# EAGLE schematic Arduino-Teensy-v5_PLUS_ESP-12E_4LAYER (EAGLE 8.6.0)
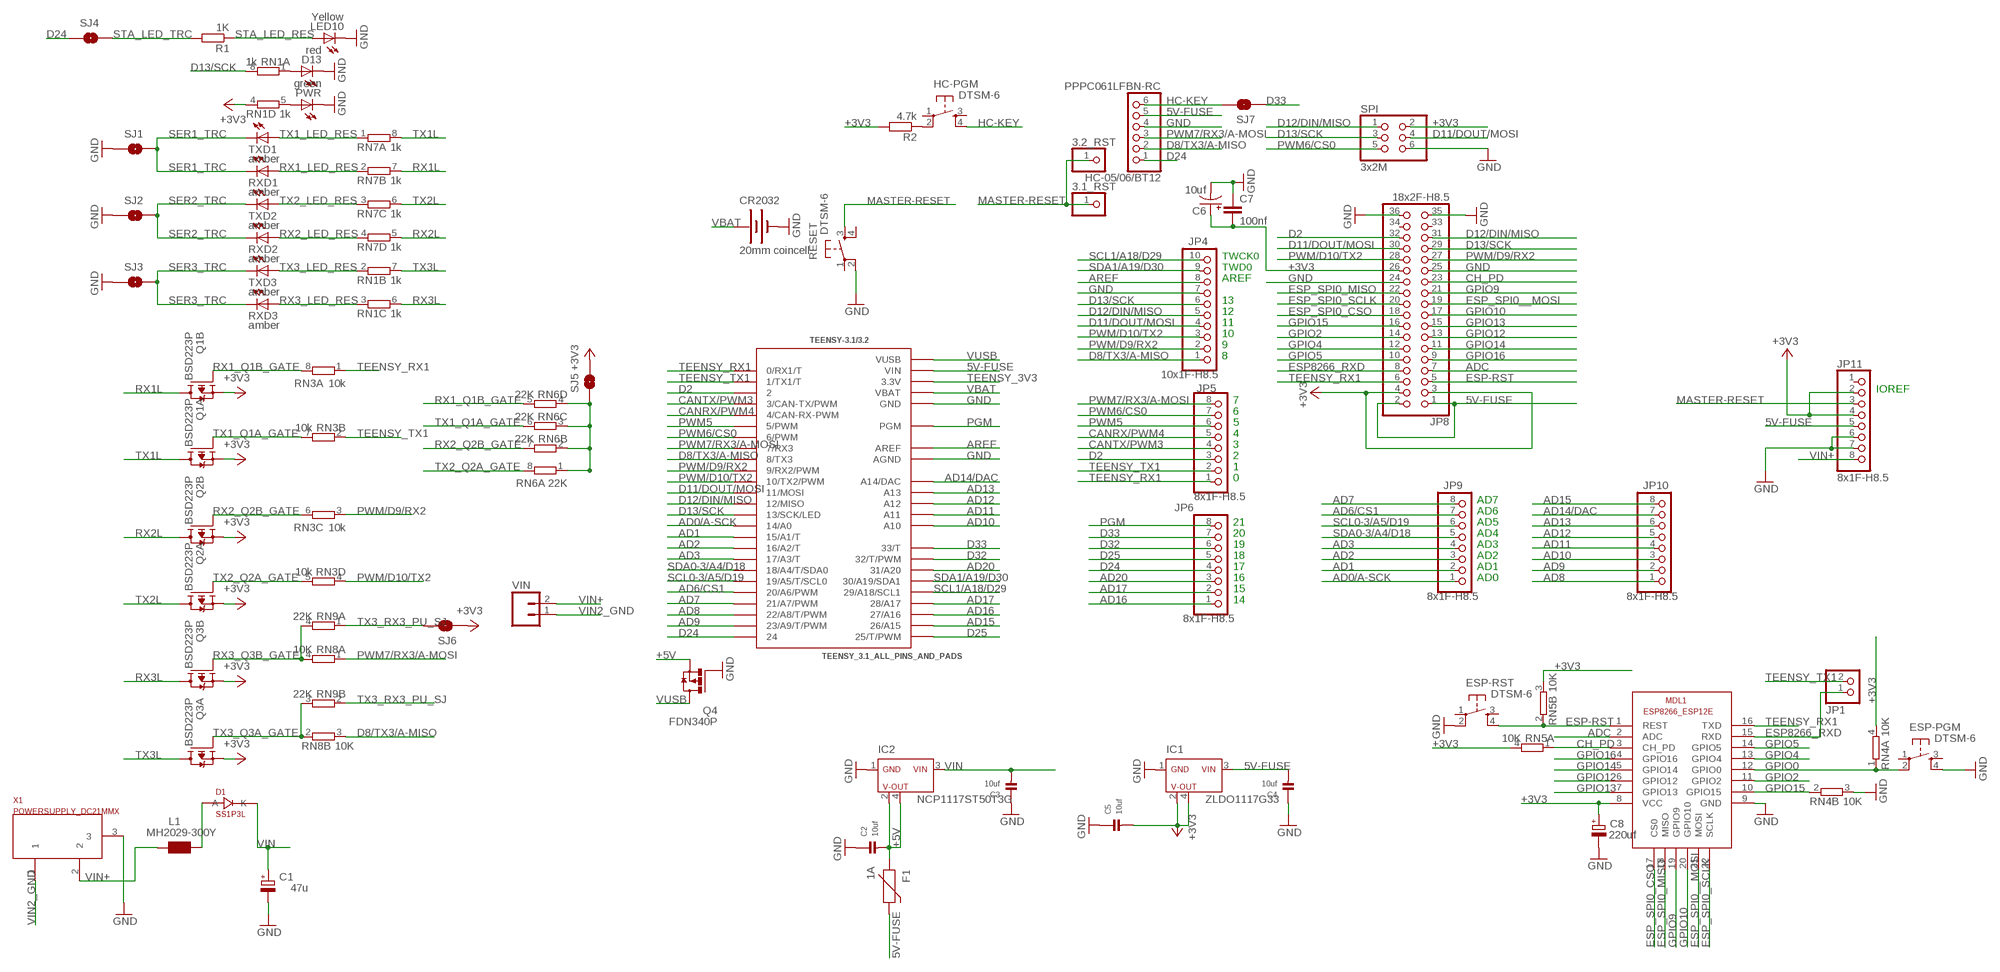
[diagram p0: schematic, sheet 1]

## Parts
3.1_RST  PINHD-1X1CB  [1X01-CLEANBIG]
3.2_RST  PINHD-1X1CB  [1X01-CLEANBIG]
C1  47u  CPOL-EUD  [PANASONIC_D]
C2  10uf  CAP_CERAMIC0805  [0805]
C3  10uf  CAP_CERAMIC0805  [0805]
C4  10uf  CAP_CERAMIC0805  [0805]
C5  10uf  CAP_CERAMIC0805  [0805]
C6  10uf  CPOL-USA/3216-18R  [A/3216-18R]
C7  100nf  C-EUC0603  [C0603-ROUND]
C8  220uf  CPOL-EUSMCB  [SMC_B]
CR2032  20mm coincell  BATTERY20MM_4LEGS  [BATTCON_20MM_4LEGS]
D1  SS1P3L  [DO220AAL]
D13  red  LEDCHIPLED_0805  [CHIPLED_0805]
ESP-PGM  DTSM-6  [DTSM-6]
ESP-RST  DTSM-6  [DTSM-6]
F1  1A  PTCSMD  [PTC-1206]
HC-05/06/BT12  PPPC061LFBN-RC  PINHD-1X6  [1X06]
HC-PGM  DTSM-6  [DTSM-6]
IC1  ZLDO1117G33  [SOT223]
IC2  NCP1117ST50T3G  [SOT223]
JP1  PINHD-1X2  [1X02]
JP4  10x1F-H8.5  PINHD-1X10  [1X10]
JP5  8x1F-H8.5  PINHD-1X8  [1X08]
JP6  8x1F-H8.5  PINHD-1X8  [1X08]
JP8  18x2F-H8.5  PINHD-2X18  [2X18]
JP9  8x1F-H8.5  PINHD-1X8  [1X08]
JP10  8x1F-H8.5  PINHD-1X8  [1X08]
JP11  8x1F-H8.5  PINHD-1X8  [1X08]
L1  MH2029-300Y  WE-CBF_0805  [0805]
LED10  Yellow  LEDCHIPLED_0805  [CHIPLED_0805]
MDL1  ESP8266-12E)  ESP8266-12EESP8266-ESP12E  [ESP8266-ESP12E]
PWR  green  LEDCHIPLED_0805  [CHIPLED_0805]
Q1  BSD223P  [SOT363_INFINEON]
Q2  BSD223P  [SOT363_INFINEON]
Q3  BSD223P  [SOT363_INFINEON]
Q4  FDN340P  FDN360P  [SUPER-SOT3]
R1  1K  R-EU_R0603  [R0603]
R2  4.7k  R-EU_R0603  [R0603]
RESET  DTSM-6  [DTSM-6]
RN1  1k  4R-NCAT16  [CAT16]
RN3  10k  4R-NCAT16  [CAT16]
RN4  10K  2R-NEXB34V  [EXB34V]
RN5  10K  2R-NEXB34V  [EXB34V]
RN6  22K  4R-NCAT16  [CAT16]
RN7  1k  4R-NCAT16  [CAT16]
RN8  10K  2R-NEXB34V  [EXB34V]
RN9  22K  2R-NEXB34V  [EXB34V]
RXD1  amber  LEDCHIPLED_0805  [CHIPLED_0805]
RXD2  amber  LEDCHIPLED_0805  [CHIPLED_0805]
RXD3  amber  LEDCHIPLED_0805  [CHIPLED_0805]
SJ1  SOLDERJUMPERTRACE  [SJ_2S-TRACE]
SJ2  SOLDERJUMPERTRACE  [SJ_2S-TRACE]
SJ3  SOLDERJUMPERTRACE  [SJ_2S-TRACE]
SJ4  SOLDERJUMPERTRACE  [SJ_2S-TRACE]
SJ5  SOLDERJUMPERTRACE  [SJ_2S-TRACE]
SJ6  SOLDERJUMPERTRACE  [SJ_2S-TRACE]
SJ7  SOLDERJUMPERTRACE  [SJ_2S-TRACE]
SPI  3x2M  PINHD-2X3  [2X03]
TEENSY-3.1/3.2  TEENSY_3.1_ALL_PINS_AND_PADS  [TEENSY3_ALL_PINS_&_PADS]
TXD1  amber  LEDCHIPLED_0805  [CHIPLED_0805]
TXD2  amber  LEDCHIPLED_0805  [CHIPLED_0805]
TXD3  amber  LEDCHIPLED_0805  [CHIPLED_0805]
VIN  M02LOCK_LONGPADS  [1X02_LOCK_LONGPADS]
X1  POWERSUPPLY_DC21MMX  [POWERSUPPLY_DC-21MM]

## Nets
5V-FUSE [POWER]: C4.2 F1.2 HC-05/06/BT12.5 IC1.3(VIN) JP8.1 JP8.2 JP11.5 TEENSY-3.1/3.2.VIN
+3V3 [POWER]: C5.2 C6.+ C7.2 C8.+ IC1.2(VOUT) IC1.4(VOUT) JP8.3 JP8.4 JP8.26 JP11.2 JP11.4 MDL1.8(VCC) Q1.1(A:S) Q1.4(B:S) Q2.1(A:S) Q2.4(B:S) Q3.1(A:S) Q3.4(B:S) R2.2 RN1.4 RN4.4 RN5.3 RN5.4 SJ5.2 SJ6.1 SPI.2
+5V [POWER]: C2.2 F1.1 IC2.2(VOUT) IC2.4(VOUT) Q4.2(S)
AD0/A-SCK: JP9.1 TEENSY-3.1/3.2.14/A0
AD1: JP9.2 TEENSY-3.1/3.2.15/A1(15/A1/T)
AD2: JP9.3 TEENSY-3.1/3.2.16/A2(16/A2/T)
AD3: JP9.4 TEENSY-3.1/3.2.17/A3(17/A3/T)
AD6/CS1: JP9.7 TEENSY-3.1/3.2.20/A6(20/A6/PWM)
AD7: JP9.8 TEENSY-3.1/3.2.21/A7(21/A7/PWM)
AD8: JP10.1 TEENSY-3.1/3.2.22/A8(22/A8/T/PWM)
AD9: JP10.2 TEENSY-3.1/3.2.23/A9(23/A9/T/PWM)
AD10: JP10.3 TEENSY-3.1/3.2.A10
AD11: JP10.4 TEENSY-3.1/3.2.A11
AD12: JP10.5 TEENSY-3.1/3.2.A12
AD13: JP10.6 TEENSY-3.1/3.2.A13
AD14/DAC: JP10.7 TEENSY-3.1/3.2.RESET/DAC(A14/DAC)
AD15: JP10.8 TEENSY-3.1/3.2.26(26/A15)
AD16: JP6.1 TEENSY-3.1/3.2.27(27/A16)
AD17: JP6.2 TEENSY-3.1/3.2.28(28/A17)
AD20: JP6.3 TEENSY-3.1/3.2.31(31/A20)
ADC: JP8.7 MDL1.2(ADC)
AREF: JP4.8 TEENSY-3.1/3.2.AREF
CANRX/PWM4: JP5.5 TEENSY-3.1/3.2.4(4/CAN-RX-PWM)
CANTX/PWM3: JP5.4 TEENSY-3.1/3.2.3(3/CAN-TX/PWM)
CH_PD: JP8.23 MDL1.3(CH_PD) RN5.1
D2: JP5.3 JP8.32 TEENSY-3.1/3.2.2
D8/TX3/A-MISO: HC-05/06/BT12.2 JP4.1 RN8.3 TEENSY-3.1/3.2.8(8/TX3)
D11/DOUT/MOSI: JP4.4 JP8.30 SPI.4 TEENSY-3.1/3.2.11(11/MOSI)
D12/DIN/MISO: JP4.5 JP8.31 SPI.1 TEENSY-3.1/3.2.12(12/MISO)
D13/SCK: JP4.6 JP8.29 RN1.8 SPI.3 TEENSY-3.1/3.2.13(13/SCK/LED)
D24: HC-05/06/BT12.1 JP6.4 SJ4.1 TEENSY-3.1/3.2.24
D25: JP6.5 TEENSY-3.1/3.2.25(25/T/PWM)
D32: JP6.6 TEENSY-3.1/3.2.32(32/T/PWM)
D33: JP6.7 SJ7.2 TEENSY-3.1/3.2.33(33/T)
ESP8266_RXD: JP1.1 JP8.8 MDL1.15(RXD)
ESP-RST: ESP-RST.4 JP8.5 MDL1.1(REST) RN5.2
ESP_SPI0__MOSI: JP8.19 MDL1.21(MOSI)
ESP_SPI0_CSO: JP8.18 MDL1.17(CS0)
ESP_SPI0_MISO: JP8.22 MDL1.18(MISO)
ESP_SPI0_SCLK: JP8.20 MDL1.22(SCLK)
GND: C1.- C2.1 C3.1 C4.1 C5.1 C6.- C7.1 C8.- CR2032.NEGATIVE(-) D13.C ESP-PGM.4 ESP-RST.2 HC-05/06/BT12.4 IC1.1(GND) IC2.1(GND) JP4.7 JP8.24 JP8.25 JP8.35 JP8.36 JP11.6 JP11.7 LED10.C MDL1.9(GND) PWR.C Q4.1(G) RESET.2 RN4.3 SJ1.1 SJ2.1 SJ3.1 SPI.6 TEENSY-3.1/3.2.AGND TEENSY-3.1/3.2.GND TEENSY-3.1/3.2.GND1(GND) TEENSY-3.1/3.2.GND2(GND) X1.3
GPIO0: ESP-PGM.2 MDL1.12(GPIO0) RN4.1
GPIO2: JP8.14 MDL1.11(GPIO2)
GPIO4: JP8.12 MDL1.13(GPIO4)
GPIO5: JP8.10 MDL1.14(GPIO5)
GPIO9: JP8.21 MDL1.19(GPIO9)
GPIO10: JP8.17 MDL1.20(GPIO10)
GPIO12: JP8.13 MDL1.6(GPIO12)
GPIO13: JP8.15 MDL1.7(GPIO13)
GPIO14: JP8.11 MDL1.5(GPIO14)
GPIO15: JP8.16 MDL1.10(GPIO15) RN4.2
GPIO16: JP8.9 MDL1.4(GPIO16)
HC-KEY: HC-05/06/BT12.6 HC-PGM.4 SJ7.1
MASTER-RESET: 3.1_RST.1 3.2_RST.1 JP11.3 RESET.3
N$2: PWR.A RN1.5
N$3: D13.A RN1.1
N$4: HC-PGM.2 R2.1
PGM: JP6.8 TEENSY-3.1/3.2.PGM
PWM5: JP5.6 TEENSY-3.1/3.2.5(5/PWM)
PWM6/CS0: JP5.7 SPI.5 TEENSY-3.1/3.2.6(6/PWM)
PWM7/RX3/A-MOSI: HC-05/06/BT12.3 JP5.8 RN8.1 TEENSY-3.1/3.2.7(7/RX3)
PWM/D9/RX2: JP4.2 JP8.27 RN3.3 TEENSY-3.1/3.2.9(9/RX2/PWM)
PWM/D10/TX2: JP4.3 JP8.28 RN3.4 TEENSY-3.1/3.2.10(10/TX2/PWM)
RX1_LED_RES: RN7.2 RXD1.A
RX1_Q1B_GATE: Q1.5(B:G) RN3.8 RN6.5
RX1_TX1_RX2_TX2_PU_SJ: RN6.1 RN6.2 RN6.3 RN6.4 SJ5.1
RX1L: Q1.3(B:D) RN7.7
RX2_LED_RES: RN7.4 RXD2.A
RX2_Q2B_GATE: Q2.5(B:G) RN3.6 RN6.7
RX2L: Q2.3(B:D) RN7.5
RX3_LED_RES: RN1.3 RXD3.A
RX3_Q3B_GATE: Q3.5(B:G) RN8.4 RN9.4
RX3L: Q3.3(B:D) RN1.6
SCL0-3/A5/D19: JP9.6 TEENSY-3.1/3.2.19/A5(19/A5/T/SCL0)
SCL1/A18/D29: JP4.10 TEENSY-3.1/3.2.29(29/A18/SCL1)
SDA0-3/A4/D18: JP9.5 TEENSY-3.1/3.2.18/A4(18/A4/T/SDA0)
SDA1/A19/D30: JP4.9 TEENSY-3.1/3.2.30(30/A19/SDA1)
SER1_TRC: RXD1.C SJ1.2 TXD1.C
SER2_TRC: RXD2.C SJ2.2 TXD2.C
SER3_TRC: RXD3.C SJ3.2 TXD3.C
STA_LED_RES: LED10.A R1.1
STA_LED_TRC: R1.2 SJ4.2
TEENSY_3V3 [POWER]: TEENSY-3.1/3.2.3.3V TEENSY-3.1/3.2.3.3V1(3.3V) TEENSY-3.1/3.2.3.3V2(3.3V)
TEENSY_RX1: JP5.1 JP8.6 MDL1.16(TXD) RN3.1 TEENSY-3.1/3.2.0(0/RX1/T)
TEENSY_TX1: JP1.2 JP5.2 RN3.2 TEENSY-3.1/3.2.1(1/TX1/T)
TX1_LED_RES: RN7.1 TXD1.A
TX1_Q1A_GATE: Q1.2(A:G) RN3.7 RN6.6
TX1L: Q1.6(A:D) RN7.8
TX2_LED_RES: RN7.3 TXD2.A
TX2_Q2A_GATE: Q2.2(A:G) RN3.5 RN6.8
TX2L: Q2.6(A:D) RN7.6
TX3_LED_RES: RN1.2 TXD3.A
TX3_Q3A_GATE: Q3.2(A:G) RN8.2 RN9.3
TX3_RX3_PU_SJ: RN9.1 RN9.2 SJ6.2
TX3L: Q3.6(A:D) RN1.7
VBAT: CR2032.POSITIVE@1(+) CR2032.POSITIVE@2(+) CR2032.POSITIVE@3(+) CR2032.POSITIVE@4(+) TEENSY-3.1/3.2.VBAT
VIN [POWER]: C1.+ C3.2 D1.P$1(K) IC2.3(VIN)
VIN2_GND: VIN.1 X1.1
VIN+ [POWER]: JP11.8 L1.2 VIN.2 X1.2
VIN_FER_DIO [POWER]: D1.P$2(A) L1.1
VUSB [POWER]: Q4.3(D) TEENSY-3.1/3.2.VUSB
Unconnected: ESP-PGM.1 ESP-PGM.3 ESP-RST.1 ESP-RST.3 HC-PGM.1 HC-PGM.3 JP8.33 JP8.34 JP11.1 RESET.1 RESET.4

## Notes on the sheet
- TWCK0
- TWD0
- AREF
- 13
- 12
- 11
- 10
- 9
- 8
- IOREF
- 7
- 6
- 5
- 4
- 3
- 2
- 1
- 0
- AD7
- AD6
- 21 | AD5
- 20 | AD4
- 19 | AD3
- 18 | AD2
- 17 | AD1
- 16 | AD0
- 15
- 14

## Library data of the parts
3.1_RST 3.2_RST = adafruit:PINHD-1X1: Pin header 1x1 for 0.1" spacing With round pins
C1 C8 = rcl:CPOL-EU: POLARIZED CAPACITOR, European symbol
C2-C5 = Adafruit_LSM303DLHC:CAP_CERAMIC: Ceramic Capacitors 0402 - 0402 Surface Mount Capacitors 16pF 50V 5% [Digikey: 445-4899-2-ND] 18pF 50V 5% [Digikey: 490-1281-2-ND] 22pF 50V 5% [Digikey: 490-1283-2-ND] 68pF 50V 5% [Digikey: 490-1289-2-ND] 0.1uF 10V 10% [Digikey: 490-1318-2-ND] 1.0uF 6.3V 10% [Digikey: 490-1320-2-ND] 0603 - 0603 Surface Mount Capacitors 16 pF 50V 5% [Digikey: 445-5051-2-ND] 22 pF 50V [Digikey: PCC220ACVTR-ND] 33 pF 50V 5% [Digikey: 490-1415-1-ND] 56pF 50V 5% [Digikey: 490-1421-1-ND] 220pF 50V 5% [Digikey: 445-1285-1-ND] 680 pF 50V 2200 pF 50V 5% C0G [Digikey: 445-1297-1-ND] 5600 pF 100V 5% X7R [Digikey: 478-3711-1-ND] 0.1 µF 25V 10% [Digikey: PCC2277TR-ND] 0.22 µF 16V 10% X7R [Digikey: 445-1318-1-ND] 1.0 µF 25V 10% [Digikey: 445-5146-2-ND] 0603 - RF Specific 3pF 250V +/-0.1pF RF [Digikey: 712-1347-1-ND] 18 pF 250V 5% [Digikey: 478-3505-1-ND or 712-1322-1-ND] 56 pF 250V 5% C0G RF [Digikey: 490-4867-1-ND] 68 pF 250V RF [Digikey: 490-4868-1-ND] 0805 - 0805 Surface Mount Capacitors 220 pF 250V 2% RF Ceramic Capacitor [Digikey: 712-1398-1-ND] 1000 pF 50V 2% NP0 Ceramic Capacitor [Digikey: 478-3760-1-ND] 0.1 µF 25V 10% Ceramic Capacitor [Digikey: PCC1828TR-ND] 1.0 µF 16V 10% Ceramic Capacitor[Digikey: 490-1691-2-ND] 10.0 µF 10V 10% Ceramic Capacitor[Digikey: 709-1228-1-ND] 10.0 uF 16V 10% Ceramic Capacitor [Digikey: 478-5165-2-ND] 47 uF 6.3V 20% Ceramic Capacitor [Digikey: 587-1779-1-ND or 399-5506-1-ND] 1206 - 1206 Surface Mount Capacitors 47uF 10V 20% Ceramic Capacitor [Digikey: 490-5528-1-ND or 399-5508-1-ND or 445-6010-1-ND] 100uF 6.3V -20%, +80% Y5V Ceramic Capacitor (Digikey: 490-4512-1-ND, Mouser: 81-GRM31CF50J107ZE1L)
C6 = adafruit:CPOL-US: POLARIZED CAPACITOR, American symbol
C7 = SmartPrj:C-EU: CAPACITOR, European symbol
CR2032 = SparkFun-Electromechanical:BATTERY: Battery Holders Various common sizes : AA, AAA, 18650 (PRT-12895), 20mm coin cell and 12mm coin cell. 20MM_4LEGS, BATT-10373; PROD_ID: BATT-10373
D1 = SmartPrj:SS1P3L
D13 LED10 PWR RXD1-RXD3 TXD1-TXD3 = adafruit:LED: LED OSRAM: - CHIPLED LG R971, LG N971, LY N971, LG Q971, LY Q971, LO R971, LY R971 LH N974, LH R974 LS Q976, LO Q976, LY Q976 LO Q996 - Hyper CHIPLED LW Q18S LB Q993, LB Q99A, LB R99A - SideLED LS A670, LO A670, LY A670, LG A670, LP A670 LB A673, LV A673, LT A673, LW A673 LH A674 LY A675 LS A676, LA A676, LO A676, LY A676, LW A676 LS A679, LY A679, LG A679 - Hyper Micro SIDELED® LS Y876, LA Y876, LO Y876, LY Y876 LT Y87S - SmartLED LW L88C, LW L88S LB L89C, LB L89S, LG L890 LS L89K, LO L89K, LY L89K LS L896, LA L896, LO L896, LY L896 - TOPLED LS T670, LO T670, LY T670, LG T670, LP T670 LSG T670, LSP T670, LSY T670, LOP T670, LYG T670 LG T671, LOG T671, LSG T671 LB T673, LV T673, LT T673, LW T673 LH T674 LS T676, LA T676, LO T676, LY T676, LB T676, LH T676, LSB T676, LW T676 LB T67C, LV T67C, LT T67C, LS T67K, LO T67K, LY T67K, LW E67C LS E67B, LA E67B, LO E67B, LY E67B, LB E67C, LV E67C, LT E67C LW T67C LS T679, LY T679, LG T679 LS T770, LO T770, LY T770, LG T770, LP T770 LB T773, LV T773, LT T773, LW T773 LH T774 LS E675, LA E675, LY E675, LS T675 LS T776, LA T776, LO T776, LY T776, LB T776 LHGB T686 LT T68C, LB T68C - Hyper Mini TOPLED® LB M676 - Mini TOPLED Santana® LG M470 LS M47K, LO M47K, LY M47K Source: http://www.osram.convergy.de/
ESP-PGM ESP-RST HC-PGM RESET = switch-tact:DTSM-6
F1 = SparkFun:PTC: Resettable Fuse PTC Resettable Fuse. Spark Fun Electronics SKU : COM-08357
HC-05/06/BT12 = pinhead:PINHD-1X6: PIN HEADER
IC1 = my-custom-lib:ZLDO1117G33: 3-Terminal 3.3V Positive Regulator Source:https://www.diodes.com/assets/Datasheets/ZLDO1117.pdf
IC2 = my-custom-lib:NCP1117ST50T3G: 3-Terminal 5V Positive Regulator Source:https://www.onsemi.com/pub/Collateral/NCP1117-D.PDF
JP1 = pinhead:PINHD-1X2: PIN HEADER
JP4 = SmartPrj:PINHD-1X10: PIN HEADER
JP5 JP6 JP9-JP11 = SmartPrj:PINHD-1X8: PIN HEADER
JP8 = SmartPrj:PINHD-2X18: PIN HEADER
L1 = wuerth-elektronik:WE-CBF: SMD EMI Suppression Ferrite Beads - excellent anti-EMI properties - low DCR - impedances till 3000 ohms - rated current up to 6 A
MDL1 = ESP8266-ESP12E:ESP8266-12E: ESP8266-12E with additional I/O and GPIO04/05 corrected The author cannot warrant that this library is free from error or will meet your specific requirements. Created by PuceBaboon.com. Komagane, Nagano, JAPAN
Q1-Q3 = transistor-fet:BSD223P: OptiMOS(R)-P Small-Signal-Transistor Dual P-Channel, Enhancement mode, Super Logic Level (2.5 V rated) Source: http://www.infineon.com/upload/Document/BSD223P_Rev1.3.pdf
Q4 = transistor-power:FDN360P: Single P-Channel, PowerTrench (R) MOSFET Source: http://www.fairchildsemi.com/ds/FD/FDN360P.pdf
R1 R2 = rcl:R-EU_: RESISTOR, European symbol
RN1 RN3 RN6 RN7 = resistor-dil:4R-N: Array Chip Resistor Source: RS Component / Phycomp; OC_FARNELL: unknown; OC_NEWARK: unknown
RN4 RN5 RN8 RN9 = resistor-dil:2R-N: Array Chip Resistor Source: Panasonic; OC_FARNELL: unknown; OC_NEWARK: unknown
SJ1-SJ7 = SparkFun:SOLDERJUMPER: Solder Jumper Standard SMD solder jumper. Used to automate production. Two varients : Normally Open and Normally Closed are the same, but have different paste layers. NC will have a large amount of paste and should jumper during reflow.
SPI = SmartPrj:PINHD-2X3: PIN HEADER
TEENSY-3.1/3.2 = Teensy_3_and_LC_Series_Boards_v1.1:TEENSY_3.1_ALL_PINS_AND_PADS: Footprint for Teensy 3.1 or 3.2 board using all pads and all through-holes. Pads need a 2x7 0.1" SMD header.
VIN = SparkFun:M02: Header 2 Standard 2-pin 0.1" header. Use with straight break away headers (SKU : PRT-00116), right angle break away headers (PRT-00553), swiss pins (PRT-00743), machine pins (PRT-00117), and female headers (PRT-00115). Molex polarized connector foot print use with SKU : PRT-08233 with associated crimp pins and housings.
X1 = SmartPrj:POWERSUPPLY_DC21MM

## Net classes
0 default: width 0.152 mm, drill 0.305 mm, clearance 0.152 mm
1 POWER: width 0.305 mm, drill 0.305 mm, clearance 0.203 mm
2 gnd: width 0.203 mm, drill 0.406 mm, clearance 0.203 mm